# EAGLE design BMS Segment rev15 (EAGLE 9.6.2)
ENGINEER: Arvind Srinivasan
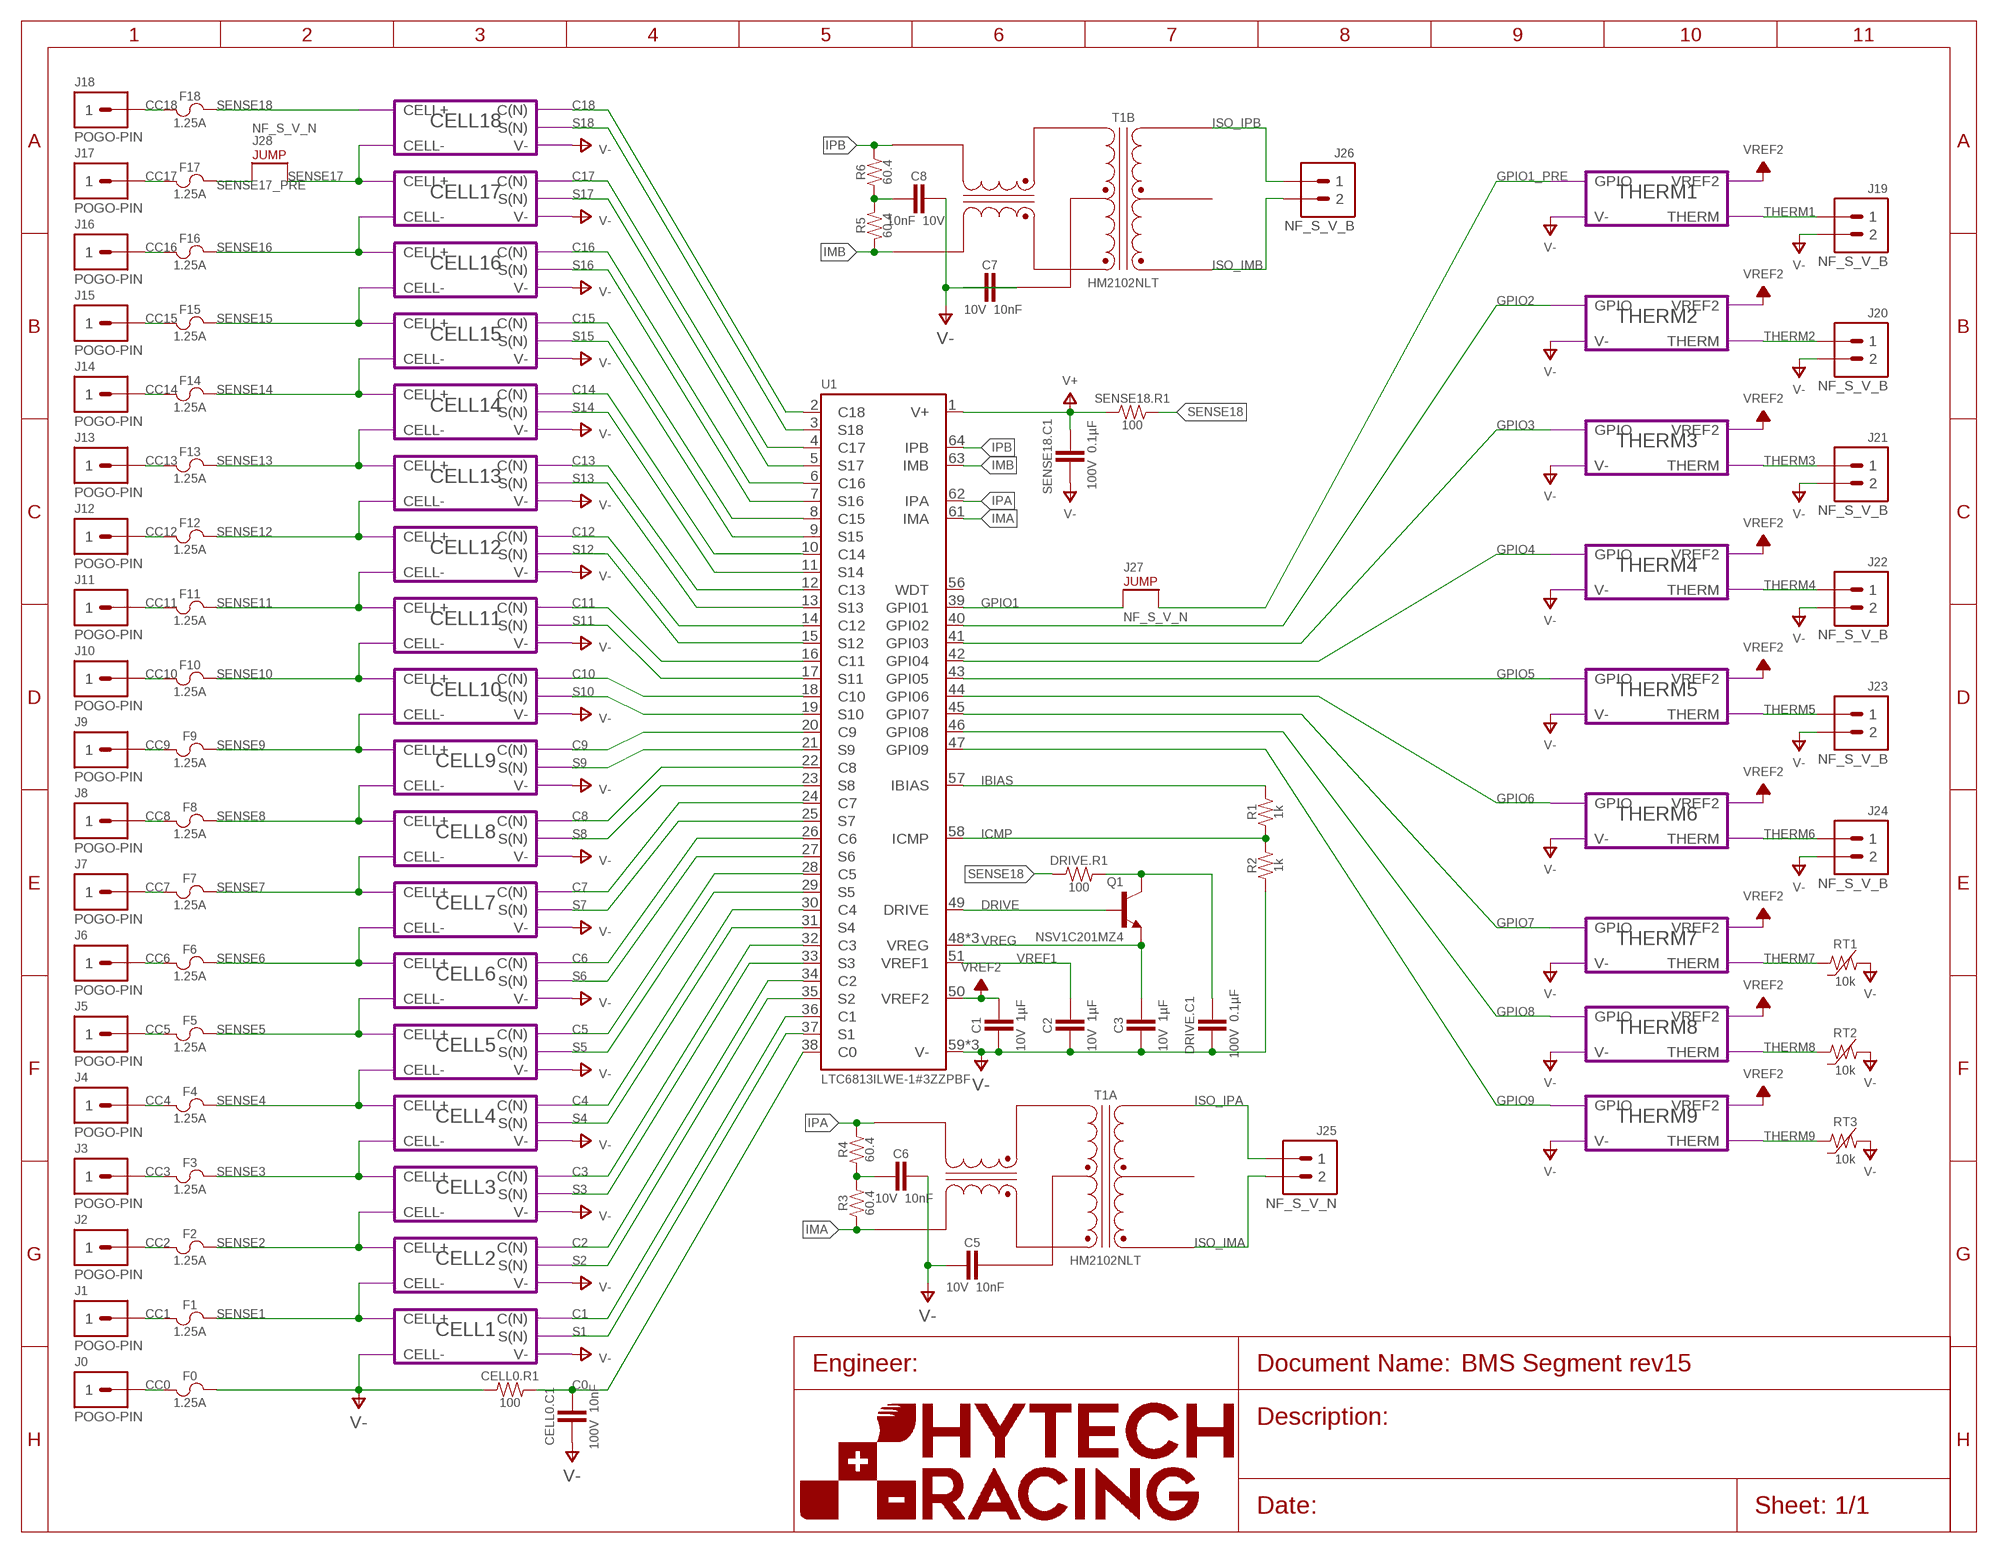
[diagram p0: schematic, sheet 1]
U$1 (FRAME_A): FRAME_DESCRIPTION: Default; ORIENTATION: LANDSCAPE; SIZE: A

## Parts
C1  CAPACITOR_0603_10V_1UF  [0603-CAP]
C2  CAPACITOR_0603_10V_1UF  [0603-CAP]
C3  CAPACITOR_0603_10V_1UF  [0603-CAP]
C5  CAPACITOR_0603_10V_10NF  [0603-CAP]
C6  CAPACITOR_0603_10V_10NF  [0603-CAP]
C7  CAPACITOR_0603_10V_10NF  [0603-CAP]
C8  CAPACITOR_0603_10V_10NF  [0603-CAP]
CELL0.C1  CAPACITOR_0603_100V_10NF  [0603-CAP]
CELL0.R1  RESISTOR_0603_100  [0603-RES]
DRIVE.C1  CAPACITOR_0603_100V_0.1UF  [0603-CAP]
DRIVE.R1  RESISTOR_0603_100  [0603-RES]
F0  FUSE0885  [0885]
F1  FUSE0885  [0885]
F2  FUSE0885  [0885]
F3  FUSE0885  [0885]
F4  FUSE0885  [0885]
F5  FUSE0885  [0885]
F6  FUSE0885  [0885]
F7  FUSE0885  [0885]
F8  FUSE0885  [0885]
F9  FUSE0885  [0885]
F10  FUSE0885  [0885]
F11  FUSE0885  [0885]
F12  FUSE0885  [0885]
F13  FUSE0885  [0885]
F14  FUSE0885  [0885]
F15  FUSE0885  [0885]
F16  FUSE0885  [0885]
F17  FUSE0885  [0885]
F18  FUSE0885  [0885]
J0  CONNECTOR-1  [807-22-001-10-02X101]
J1  CONNECTOR-1  [807-22-001-10-02X101]
J2  CONNECTOR-1  [807-22-001-10-02X101]
J3  CONNECTOR-1  [807-22-001-10-02X101]
J4  CONNECTOR-1  [807-22-001-10-02X101]
J5  CONNECTOR-1  [807-22-001-10-02X101]
J6  CONNECTOR-1  [807-22-001-10-02X101]
J7  CONNECTOR-1  [807-22-001-10-02X101]
J8  CONNECTOR-1  [807-22-001-10-02X101]
J9  CONNECTOR-1  [807-22-001-10-02X101]
J10  CONNECTOR-1  [807-22-001-10-02X101]
J11  CONNECTOR-1  [807-22-001-10-02X101]
J12  CONNECTOR-1  [807-22-001-10-02X101]
J13  CONNECTOR-1  [807-22-001-10-02X101]
J14  CONNECTOR-1  [807-22-001-10-02X101]
J15  CONNECTOR-1  [807-22-001-10-02X101]
J16  CONNECTOR-1  [807-22-001-10-02X101]
J17  CONNECTOR-1  [807-22-001-10-02X101]
J18  CONNECTOR-1  [807-22-001-10-02X101]
J19  CONNECTOR-2_NANOFIT_SMD_VERTICAL_BLACK  [MOLEX_NANOFIT_SMD_VERTICAL_02]
J20  CONNECTOR-2_NANOFIT_SMD_VERTICAL_BLACK  [MOLEX_NANOFIT_SMD_VERTICAL_02]
J21  CONNECTOR-2_NANOFIT_SMD_VERTICAL_BLACK  [MOLEX_NANOFIT_SMD_VERTICAL_02]
J22  CONNECTOR-2_NANOFIT_SMD_VERTICAL_BLACK  [MOLEX_NANOFIT_SMD_VERTICAL_02]
J23  CONNECTOR-2_NANOFIT_SMD_VERTICAL_BLACK  [MOLEX_NANOFIT_SMD_VERTICAL_02]
J24  CONNECTOR-2_NANOFIT_SMD_VERTICAL_BLACK  [MOLEX_NANOFIT_SMD_VERTICAL_02]
J25  CONNECTOR-2_NANOFIT_SMD_VERTICAL_NATURAL  [MOLEX_NANOFIT_SMD_VERTICAL_02]
J26  CONNECTOR-2_NANOFIT_SMD_VERTICAL_BLACK  [MOLEX_NANOFIT_SMD_VERTICAL_02]
J27  JUMPER_NANOFIT_SMD_VERTICAL_NATURAL  [MOLEX_NANOFIT_SMD_VERTICAL_02]
J28  JUMPER_NANOFIT_SMD_VERTICAL_NATURAL  [MOLEX_NANOFIT_SMD_VERTICAL_02]
Q1  TRANSISTOR_NPN  [SOT223]
R1  RESISTOR_0603_1K  [0603-RES]
R2  RESISTOR_0603_1K  [0603-RES]
R3  RESISTOR_0603_60.4  [0603-RES]
R4  RESISTOR_0603_60.4  [0603-RES]
R5  RESISTOR_0603_60.4  [0603-RES]
R6  RESISTOR_0603_60.4  [0603-RES]
RT1  THERMISTOR  [0603-RES]
RT2  THERMISTOR  [0603-RES]
RT3  THERMISTOR  [0603-RES]
SENSE18.C1  CAPACITOR_0603_100V_0.1UF  [0603-CAP]
SENSE18.R1  RESISTOR_0603_100  [0603-RES]
T1  TRANSFORMER  [HM2102NLT]
U1  LTC6813  [LQFP-64]

## Module instances
CELL1 = CELL
CELL2 = CELL
CELL3 = CELL
CELL4 = CELL
CELL5 = CELL
CELL6 = CELL
CELL7 = CELL
CELL8 = CELL
CELL9 = CELL
CELL10 = CELL
CELL11 = CELL
CELL12 = CELL
CELL13 = CELL
CELL14 = CELL
CELL15 = CELL
CELL16 = CELL
CELL17 = CELL
CELL18 = CELL
THERM1 = THERM
THERM2 = THERM
THERM3 = THERM
THERM4 = THERM
THERM5 = THERM
THERM6 = THERM
THERM7 = THERM
THERM8 = THERM
THERM9 = THERM

## Nets
C0: CELL0.C1.1 CELL0.R1.2 U1.38(C0)
C1: U1.36(C1) ; port CELL1.C(N)
C2: U1.34(C2) ; port CELL2.C(N)
C3: U1.32(C3) ; port CELL3.C(N)
C4: U1.30(C4) ; port CELL4.C(N)
C5: U1.28(C5) ; port CELL5.C(N)
C6: U1.26(C6) ; port CELL6.C(N)
C7: U1.24(C7) ; port CELL7.C(N)
C8: U1.22(C8) ; port CELL8.C(N)
C9: U1.20(C9) ; port CELL9.C(N)
C10: U1.18(C10) ; port CELL10.C(N)
C11: U1.16(C11) ; port CELL11.C(N)
C12: U1.14(C12) ; port CELL12.C(N)
C13: U1.12(C13) ; port CELL13.C(N)
C14: U1.10(C14) ; port CELL14.C(N)
C15: U1.8(C15) ; port CELL15.C(N)
C16: U1.6(C16) ; port CELL16.C(N)
C17: U1.4(C17) ; port CELL17.C(N)
C18: U1.2(C18) ; port CELL18.C(N)
CC0: F0.1 J0.1
CC1: F1.1 J1.1
CC2: F2.1 J2.1
CC3: F3.1 J3.1
CC4: F4.1 J4.1
CC5: F5.1 J5.1
CC6: F6.1 J6.1
CC7: F7.1 J7.1
CC8: F8.1 J8.1
CC9: F9.1 J9.1
CC10: F10.1 J10.1
CC11: F11.1 J11.1
CC12: F12.1 J12.1
CC13: F13.1 J13.1
CC14: F14.1 J14.1
CC15: F15.1 J15.1
CC16: F16.1 J16.1
CC17: F17.1 J17.1
CC18: F18.1 J18.1
DRIVE: Q1.1(BASE) U1.49(DRIVE)
GPIO1: J27.1 U1.39(GPI01)
GPIO1_PRE: J27.2 ; port THERM1.GPIO
GPIO2: U1.40(GPI02) ; port THERM2.GPIO
GPIO3: U1.41(GPI03) ; port THERM3.GPIO
GPIO4: U1.42(GPI04) ; port THERM4.GPIO
GPIO5: U1.43(GPI05) ; port THERM5.GPIO
GPIO6: U1.44(GPI06) ; port THERM6.GPIO
GPIO7: U1.45(GPI07) ; port THERM7.GPIO
GPIO8: U1.46(GPI08) ; port THERM8.GPIO
GPIO9: U1.47(GPI09) ; port THERM9.GPIO
IBIAS: R1.2 U1.57(IBIAS)
ICMP: R1.1 R2.2 U1.58(ICMP)
IMA: R3.1 T1.12(A:TD+) U1.61(IMA)
IMB: R5.2 T1.9(B:TD+) U1.63(IMB)
IPA: R4.2 T1.10(A:TD-) U1.62(IPA)
IPB: R6.2 T1.7(B:TD-) U1.64(IPB)
ISO_IMA: J25.2 T1.1(A:MX+)
ISO_IMB: J26.2 T1.4(B:MX+)
ISO_IPA: J25.1 T1.3(A:MX-)
ISO_IPB: J26.1 T1.6(B:MX-)
N$3: C5.1 T1.11(A:TCT)
N$4: C7.2 T1.8(B:TCT)
N$5: C6.2 R3.2 R4.1
N$15: DRIVE.C1.1 DRIVE.R1.2 Q1.2(COLLECTOR) Q1.4(COLLECTOR)
N$18: C8.1 R5.1 R6.1
S1: U1.37(S1) ; port CELL1.S(N)
S2: U1.35(S2) ; port CELL2.S(N)
S3: U1.33(S3) ; port CELL3.S(N)
S4: U1.31(S4) ; port CELL4.S(N)
S5: U1.29(S5) ; port CELL5.S(N)
S6: U1.27(S6) ; port CELL6.S(N)
S7: U1.25(S7) ; port CELL7.S(N)
S8: U1.23(S8) ; port CELL8.S(N)
S9: U1.21(S9) ; port CELL9.S(N)
S10: U1.19(S10) ; port CELL10.S(N)
S11: U1.17(S11) ; port CELL11.S(N)
S12: U1.15(S12) ; port CELL12.S(N)
S13: U1.13(S13) ; port CELL13.S(N)
S14: U1.11(S14) ; port CELL14.S(N)
S15: U1.9(S15) ; port CELL15.S(N)
S16: U1.7(S16) ; port CELL16.S(N)
S17: U1.5(S17) ; port CELL17.S(N)
S18: U1.3(S18) ; port CELL18.S(N)
SENSE1: F1.2 ; port CELL1.CELL+ CELL2.CELL-
SENSE2: F2.2 ; port CELL2.CELL+ CELL3.CELL-
SENSE3: F3.2 ; port CELL3.CELL+ CELL4.CELL-
SENSE4: F4.2 ; port CELL4.CELL+ CELL5.CELL-
SENSE5: F5.2 ; port CELL5.CELL+ CELL6.CELL-
SENSE6: F6.2 ; port CELL6.CELL+ CELL7.CELL-
SENSE7: F7.2 ; port CELL7.CELL+ CELL8.CELL-
SENSE8: F8.2 ; port CELL8.CELL+ CELL9.CELL-
SENSE9: F9.2 ; port CELL9.CELL+ CELL10.CELL-
SENSE10: F10.2 ; port CELL10.CELL+ CELL11.CELL-
SENSE11: F11.2 ; port CELL11.CELL+ CELL12.CELL-
SENSE12: F12.2 ; port CELL12.CELL+ CELL13.CELL-
SENSE13: F13.2 ; port CELL13.CELL+ CELL14.CELL-
SENSE14: F14.2 ; port CELL14.CELL+ CELL15.CELL-
SENSE15: F15.2 ; port CELL15.CELL+ CELL16.CELL-
SENSE16: F16.2 ; port CELL16.CELL+ CELL17.CELL-
SENSE17: J28.2 ; port CELL17.CELL+ CELL18.CELL-
SENSE17_PRE: F17.2 J28.1
SENSE18: DRIVE.R1.1 F18.2 SENSE18.R1.2 ; port CELL18.CELL+
THERM1: J19.1 ; port THERM1.THERM
THERM2: J20.1 ; port THERM2.THERM
THERM3: J21.1 ; port THERM3.THERM
THERM4: J22.1 ; port THERM4.THERM
THERM5: J23.1 ; port THERM5.THERM
THERM6: J24.1 ; port THERM6.THERM
THERM7: RT1.2 ; port THERM7.THERM
THERM8: RT2.2 ; port THERM8.THERM
THERM9: RT3.2 ; port THERM9.THERM
V+: SENSE18.C1.1 SENSE18.R1.1 U1.1(V+)
V-: C1.2 C2.2 C3.2 C5.2 C6.1 C7.1 C8.2 CELL0.C1.2 CELL0.R1.1 DRIVE.C1.2 F0.2 J19.2 J20.2 J21.2 J22.2 J23.2 J24.2 R2.1 RT1.1 RT2.1 RT3.1 SENSE18.C1.2 U1.59(V-) U1.60(V-) U1.65(V-) ; port CELL1.CELL- CELL1.V- CELL2.V- CELL3.V- CELL4.V- CELL5.V- CELL6.V- CELL7.V- CELL8.V- CELL9.V- CELL10.V- CELL11.V- CELL12.V- CELL13.V- CELL14.V- CELL15.V- CELL16.V- CELL17.V- CELL18.V- THERM1.V- THERM2.V- THERM3.V- THERM4.V- THERM5.V- THERM6.V- THERM7.V- THERM8.V- THERM9.V-
VREF1: C2.1 U1.51(VREF1)
VREF2: C1.1 U1.50(VREF2) ; port THERM1.VREF2 THERM2.VREF2 THERM3.VREF2 THERM4.VREF2 THERM5.VREF2 THERM6.VREF2 THERM7.VREF2 THERM8.VREF2 THERM9.VREF2
VREG: C3.1 Q1.3(EMITTER) U1.48(VREG) U1.52(VREG) U1.55(VREG)
Unconnected: T1.2(A:MCT) T1.5(B:MCT) U1.56(WDT)

## Library data of the parts
C1-C3 = HyTechDevices:CAPACITOR_?_*: Capacitor, Non-Polarized VJ...1BC Series Datasheet <https://www.mouser.com/datasheet/2/427/vjw1bcbascomseries-1762447.pdf> Samsung Datasheet <https://www.mouser.com/datasheet/2/585/MLCC-1837944.pdf> Walsin Datasheet <https://www.mouser.com/datasheet/2/210/WTC_MLCC_General_Purpose-1534899.pdf>; CAPACITANCE: 1µF; DKPN: 311-1796-1-ND; MANUFACTURER: Yageo; MOPN: 603-CC603KRX7R6BB105; MPN: CC0603KRX7R6BB105; TOLERANCE: 10%; VOLTAGE: 10V
C5-C8 = HyTechDevices:CAPACITOR_?_*: Capacitor, Non-Polarized VJ...1BC Series Datasheet <https://www.mouser.com/datasheet/2/427/vjw1bcbascomseries-1762447.pdf> Samsung Datasheet <https://www.mouser.com/datasheet/2/585/MLCC-1837944.pdf> Walsin Datasheet <https://www.mouser.com/datasheet/2/210/WTC_MLCC_General_Purpose-1534899.pdf>; CAPACITANCE: 10nF; DKPN: 311-4054-1-ND; MANUFACTURER: Yageo; MOPN: 603-CC603KRX7R6BB103; MPN: CC0603KRX7R6BB103; TOLERANCE: 10%; VOLTAGE: 10V
CELL0.C1 = HyTechDevices:CAPACITOR_?_*: Capacitor, Non-Polarized VJ...1BC Series Datasheet <https://www.mouser.com/datasheet/2/427/vjw1bcbascomseries-1762447.pdf> Samsung Datasheet <https://www.mouser.com/datasheet/2/585/MLCC-1837944.pdf> Walsin Datasheet <https://www.mouser.com/datasheet/2/210/WTC_MLCC_General_Purpose-1534899.pdf>; CAPACITANCE: 10nF; DKPN: 311-1788-1-ND; MANUFACTURER: Yageo; MOPN: 603-CC603KRX7R0BB103; MPN: CC0603KRX7R0BB103; TOLERANCE: 10%; VOLTAGE: 100V
CELL0.R1 DRIVE.R1 SENSE18.R1 = HyTechDevices:RESISTOR_?_*: Resistor PWR163 Series <https://www.mouser.com/datasheet/2/54/pwr163-777985.pdf> AC Series <https://www.mouser.com/datasheet/2/447/Yageo_PYu_AC_51_RoHS_L_7_1714230-1874691.pdf> PU Series <https://www.mouser.com/datasheet/2/447/PYu-PU_51_RoHS_L_6-1504619.pdf>; DKPN: 311-100HRCT-ND; MANUFACTURER: Yageo; MOPN: 603-RC0603FR-07100RL; MPN: RC0603FR-07100RL; POWER: 0.1W; RESISTANCE: 100; TOLERANCE: 1%; VOLTAGE: 75V
DRIVE.C1 SENSE18.C1 = HyTechDevices:CAPACITOR_?_*: Capacitor, Non-Polarized VJ...1BC Series Datasheet <https://www.mouser.com/datasheet/2/427/vjw1bcbascomseries-1762447.pdf> Samsung Datasheet <https://www.mouser.com/datasheet/2/585/MLCC-1837944.pdf> Walsin Datasheet <https://www.mouser.com/datasheet/2/210/WTC_MLCC_General_Purpose-1534899.pdf>; CAPACITANCE: 0.1µF; DKPN: 311-1523-1-ND; MANUFACTURER: Yageo; MOPN: 603-CC603KRX7R0BB104; MPN: CC0603KRX7R0BB104; TOLERANCE: 10%; VOLTAGE: 100V
F0 F1-F18 = HyTechDevices:FUSE: Ceramic Surface Mount Fuse Datasheet <https://www.mouser.com/datasheet/2/358/typ_SMD_SPT-1276028.pdf> Fuse/Fuseclips Keystone Electronics 3568 Fuse Mouser Part <http://www.mouser.com/ProductDetail/Keystone-Electronics/3568> Datasheet <http://www.mouser.com/ds/2/215/568-742601.pdf> Bussman/Eaton Midget Fuse Clip 1A3400 <http://www.mouser.com/ProductDetail/Bussmann-Eaton/BK-1A3400-09-R/?qs=sGAEpiMZZMuG%252bgnN5hGYGzzlAelq2OxnKqVSMVjq8I4%3d> Schurter 0751.0110 Brass Fuse Clip Datasheet <http://www.mouser.com/ds/2/358/typ_OG__Clip__5x20-2553.pdf> Bel Fuse 0ZCF Series Surface Mount PTC (resettable) Fuse Datasheet <https://belfuse.com/resources/CircuitProtection/datasheets/0ZCF%20Nov2016.pdf> Littelfuse 1812L Series Surface Mount PTC (resettable) Fuse Datasheet <https://m.littelfuse.com/~/media/electronics/datasheets/resettable_ptcs/littelfuse_ptc_1812l_datasheet.pdf.pdf> Ceramic SMD Surface Mount Fuse Datasheet <https://www.mouser.com/datasheet/2/240/Littelfuse_Fuse_885_Datasheet_pdf-1371443.pdf>; CURRENT: 1.25A; DKPN: F10986CT-ND; MANUFACTURER: Littelfuse Inc.; MOPN: 576-08851.25DR; MPN: 08851.25DR
J0 J1-J18 = HyTechDevices:CONNECTOR-1: 1 Pin Connector Pogo pin datasheet <https://www.mouser.com/datasheet/2/273/Mill-Max_03212019_807-22-001-10-020101-1545127.pdf>; DKPN: 807-22-001-10-022101-ND; MANUFACTURER: Mill-Max Manufacturing Corp.; MODEL: POGO-PIN; MOPN: 575-8072200110022101; MPN: 807-22-001-10-022101
J19-J24 J26 = HyTechDevices:CONNECTOR-2_?_*: 2 Pin Connector; MANUFACTURER: Molex; MODEL: NF_S_V_B; MPN: 1054291304
J25 = HyTechDevices:CONNECTOR-2_?_*: 2 Pin Connector; MANUFACTURER: Molex; MODEL: NF_S_V_N; MPN: 1054312302
J27 J28 = HyTechDevices:JUMPER_?_*: 2 Pin Connector; MANUFACTURER: Molex; MODEL: NF_S_V_N; MPN: 1054312302
Q1 = HyTechDevices:TRANSISTOR_NPN: NPN Transistor Datasheet <http://www.onsemi.com/pub/Collateral/NSS1C201MZ4-D.PDF> MAX current: 2.0A MAX voltage: 100V; DKPN: NSV1C201MZ4T1GOSCT-ND; MANUFACTURER: ON Semiconductor; MOPN: 863-NSV1C201MZ4T1G; MPN: NSV1C201MZ4
R1 R2 = HyTechDevices:RESISTOR_?_*: Resistor PWR163 Series <https://www.mouser.com/datasheet/2/54/pwr163-777985.pdf> AC Series <https://www.mouser.com/datasheet/2/447/Yageo_PYu_AC_51_RoHS_L_7_1714230-1874691.pdf> PU Series <https://www.mouser.com/datasheet/2/447/PYu-PU_51_RoHS_L_6-1504619.pdf>; DKPN: 311-1.00KHRCT-ND; MANUFACTURER: Yageo; MOPN: 603-RC0603FR-071KL; MPN: RC0603FR-071KL; POWER: 0.1W; RESISTANCE: 1k; TOLERANCE: 1%; VOLTAGE: 75V
R3-R6 = HyTechDevices:RESISTOR_?_*: Resistor PWR163 Series <https://www.mouser.com/datasheet/2/54/pwr163-777985.pdf> AC Series <https://www.mouser.com/datasheet/2/447/Yageo_PYu_AC_51_RoHS_L_7_1714230-1874691.pdf> PU Series <https://www.mouser.com/datasheet/2/447/PYu-PU_51_RoHS_L_6-1504619.pdf>; DKPN: 311-60.4HRCT-ND; MANUFACTURER: Yageo; MOPN: 603-RC0603FR-0760R4L; MPN: RC0603FR-0760R4L; POWER: 0.1W; RESISTANCE: 60.4; TOLERANCE: 1%; VOLTAGE: 75V
RT1-RT3 = HyTechDevices:THERMISTOR: Thermistor Datasheet Murata <https://www.murata.com/-/media/webrenewal/support/library/catalog/products/thermistor/r03e.ashx?la=en-us>; DKPN: 490-18147-1-ND; MANUFACTURER: Murata Electronics; MOPN: 81-NCU18XH103D60RB; MPN: NCU18XH103D60RB; RESISTANCE: 10k
T1 = HyTechDevices:TRANSFORMER: 2 Channel SMT Transformer Turns ratio: 1CT: 1CT Isolation Voltage: 4300 VDC Inductance: 150 uH Leakage Inductance: 0.50 uH max DataSheet <https://www.mouser.com/datasheet/2/336/HM2102NL-1218600.pdf>; DKPN: 1840-1034-1-ND; MANUFACTURER: Pulse Electronics Network; MOPN: 673-HM2102NLT; MPN: HM2102NLT
U1 = HyTechDevices:LTC6813: LTC6813 18-Cell Battery Monitor Datasheet <https://www.analog.com/media/en/technical-documentation/data-sheets/LTC6813-1.pdf>; DKPN: LTC6813ILWE-1#3ZZPBF-ND; MANUFACTURER: Analog Devices Inc.; MPN: LTC6813ILWE-1#3ZZPBF

## Module CELL
Ports: CELL+(in) S(N)(in) C(N)(out) CELL-(out) V-(pwr)
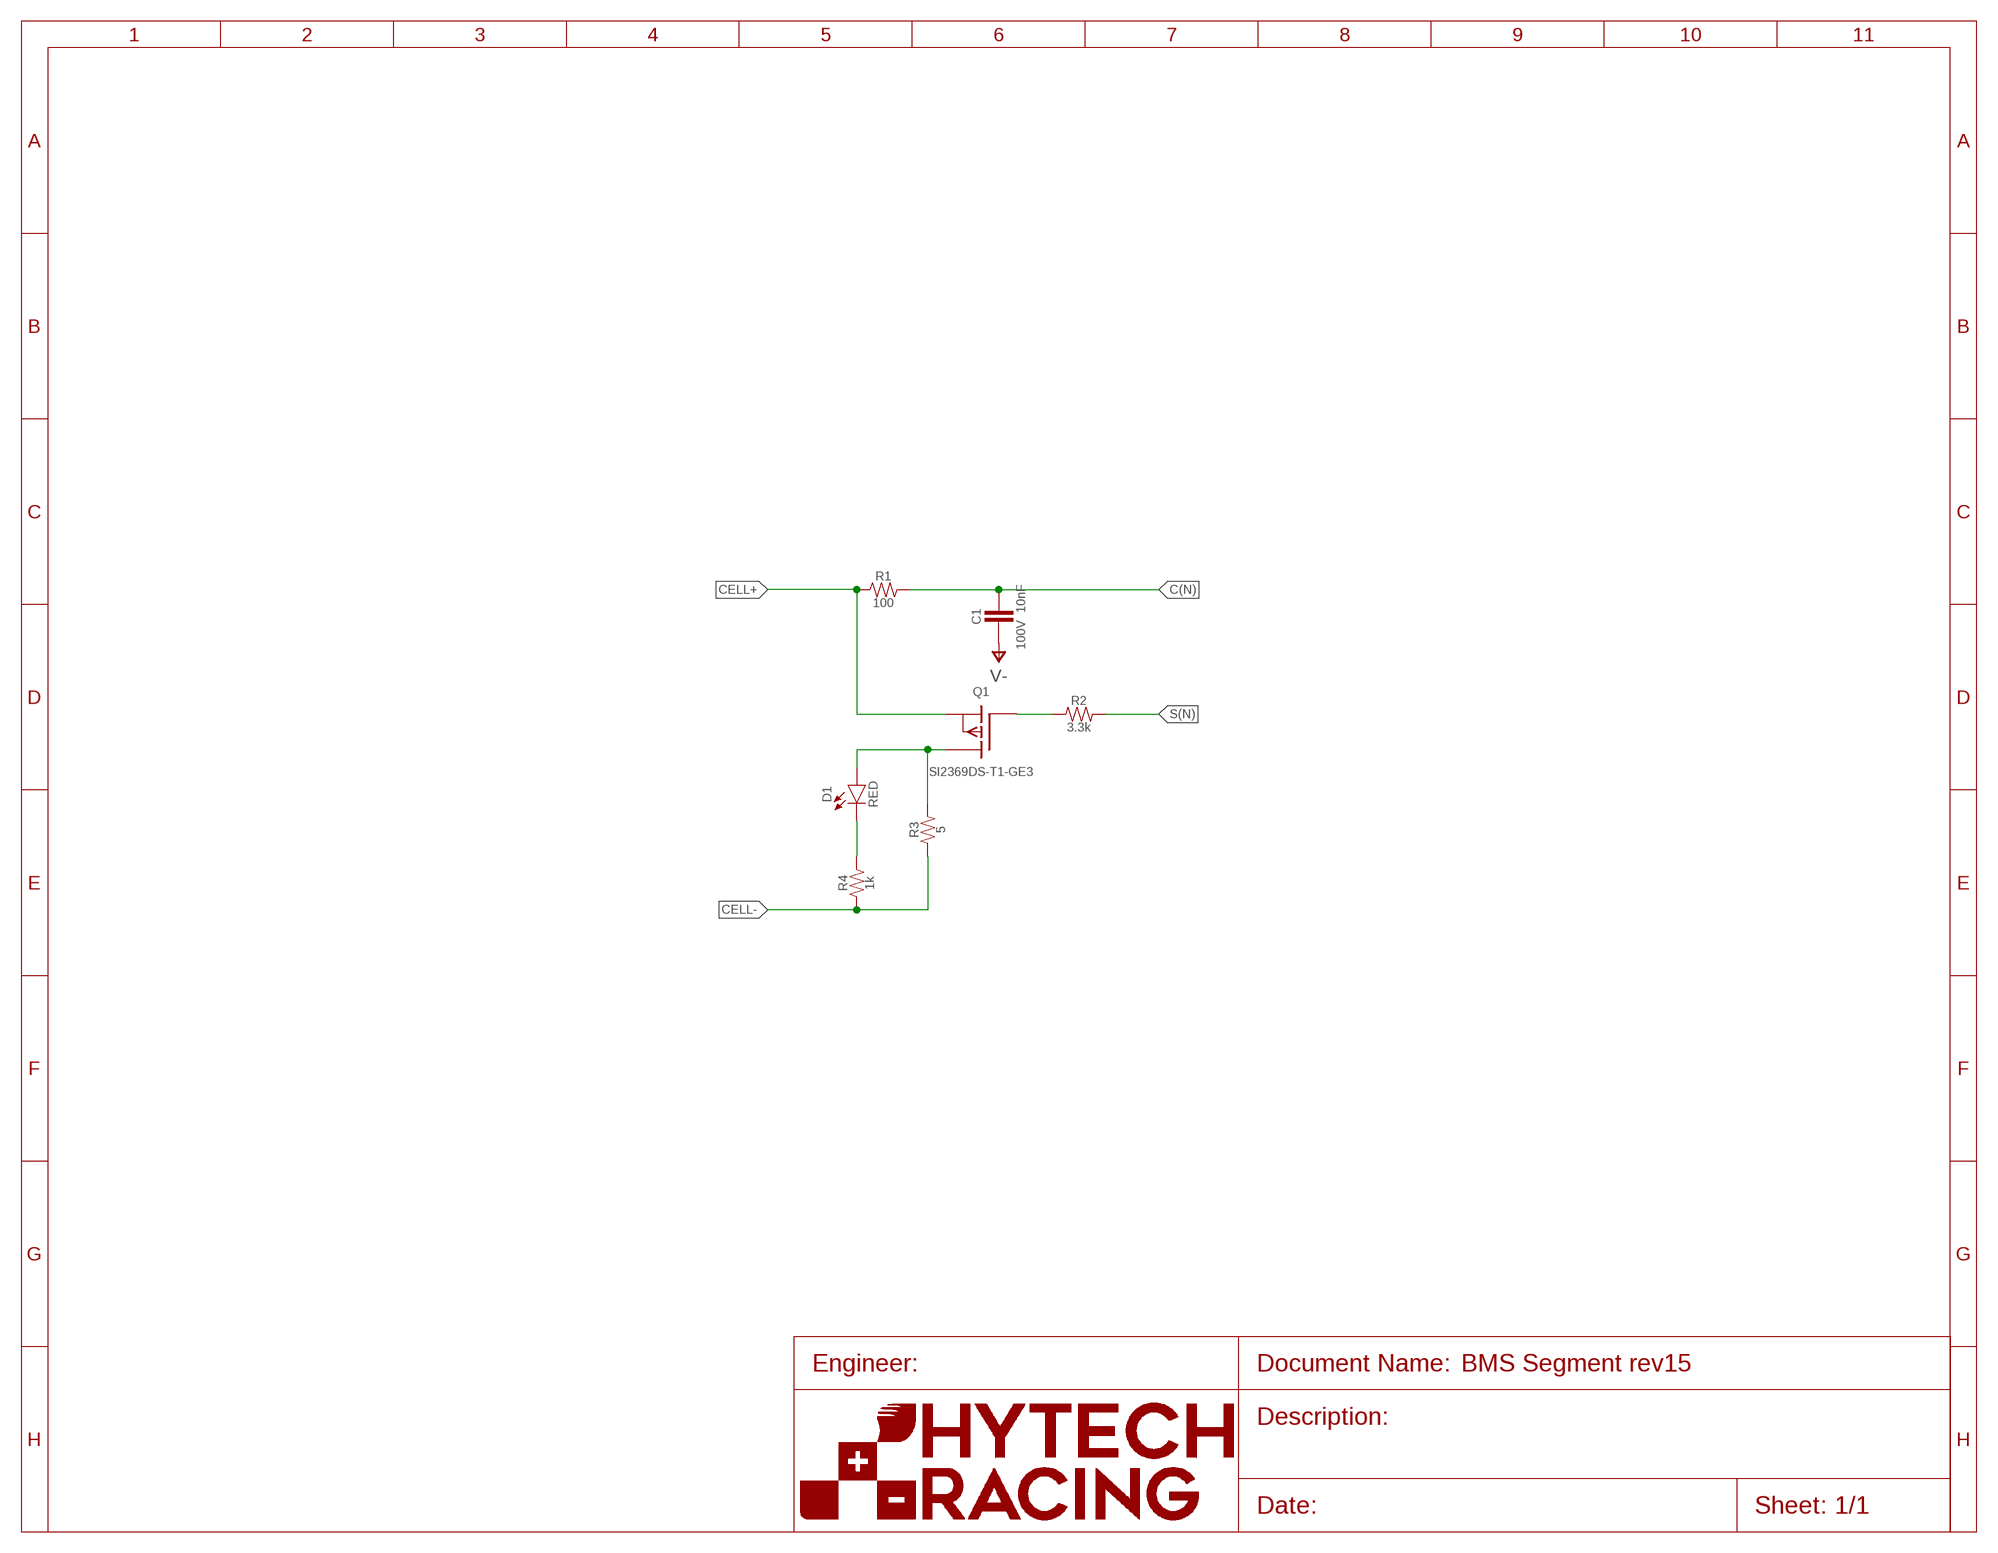
[diagram p1: schematic, module CELL, sheet 1]
U$1 (FRAME_A): FRAME_DESCRIPTION: Default; ORIENTATION: LANDSCAPE; SIZE: A

### Parts
C1  CAPACITOR_0603_100V_10NF  [0603-CAP]
D1  LED_0603_RED  [0603-LED]
Q1  TRANSISTOR_P_MOS_SOT23_SI2369DS-T1-GE3  [SOT-23]
R1  RESISTOR_0603_100  [0603-RES]
R2  RESISTOR_0603_3.3K  [0603-RES]
R3  RESISTOR_PWR163_5  [PWR163]
R4  RESISTOR_0603_1K  [0603-RES]

### Nets
C(N): C1.1 R1.2
CELL+: Q1.2(S) R1.1
CELL-: R3.1 R4.1
N$5: Q1.1(G) R2.1
N$6: D1.2(A) Q1.3(D) R3.2
N$7: D1.1(C) R4.2
S(N): R2.2
V-: C1.2

### Library data of the parts
C1 = HyTechDevices:CAPACITOR_?_*: Capacitor, Non-Polarized VJ...1BC Series Datasheet <https://www.mouser.com/datasheet/2/427/vjw1bcbascomseries-1762447.pdf> Samsung Datasheet <https://www.mouser.com/datasheet/2/585/MLCC-1837944.pdf> Walsin Datasheet <https://www.mouser.com/datasheet/2/210/WTC_MLCC_General_Purpose-1534899.pdf>; CAPACITANCE: 10nF; DKPN: 311-1788-1-ND; MANUFACTURER: Yageo; MOPN: 603-CC603KRX7R0BB103; MPN: CC0603KRX7R0BB103; TOLERANCE: 10%; VOLTAGE: 100V
D1 = HyTechDevices:LED_?_*: LED; COLOR: RED; DKPN: 754-1786-1-ND; MANUFACTURER: Kingbright; MOPN: 604-APT1608SECKJ3PRV; MPN: APT1608SECK/J3-PRV
Q1 = HyTechDevices:TRANSISTOR_P_MOS_?_*: MOSFET P Channel Datasheet <https://www.mouser.com/datasheet/2/427/si2369d-1764360.pdf>; DKPN: SI2369DS-T1-GE3CT-ND; MANUFACTURER: Vishay Siliconix; MOPN: 78-SI2369DS-T1-GE3; MPN: SI2369DS-T1-GE3
R1 = HyTechDevices:RESISTOR_?_*: Resistor PWR163 Series <https://www.mouser.com/datasheet/2/54/pwr163-777985.pdf> AC Series <https://www.mouser.com/datasheet/2/447/Yageo_PYu_AC_51_RoHS_L_7_1714230-1874691.pdf> PU Series <https://www.mouser.com/datasheet/2/447/PYu-PU_51_RoHS_L_6-1504619.pdf>; DKPN: 311-100HRCT-ND; MANUFACTURER: Yageo; MOPN: 603-RC0603FR-07100RL; MPN: RC0603FR-07100RL; POWER: 0.1W; RESISTANCE: 100; TOLERANCE: 1%; VOLTAGE: 75V
R2 = HyTechDevices:RESISTOR_?_*: Resistor PWR163 Series <https://www.mouser.com/datasheet/2/54/pwr163-777985.pdf> AC Series <https://www.mouser.com/datasheet/2/447/Yageo_PYu_AC_51_RoHS_L_7_1714230-1874691.pdf> PU Series <https://www.mouser.com/datasheet/2/447/PYu-PU_51_RoHS_L_6-1504619.pdf>; DKPN: 311-3.30KHRCT-ND; MANUFACTURER: Yageo; MOPN: 603-RC0603FR-073K3L; MPN: RC0603FR-073K3L; POWER: 0.1W; RESISTANCE: 3.3k; TOLERANCE: 1%; VOLTAGE: 75V
R3 = HyTechDevices:RESISTOR_?_*: Resistor PWR163 Series <https://www.mouser.com/datasheet/2/54/pwr163-777985.pdf> AC Series <https://www.mouser.com/datasheet/2/447/Yageo_PYu_AC_51_RoHS_L_7_1714230-1874691.pdf> PU Series <https://www.mouser.com/datasheet/2/447/PYu-PU_51_RoHS_L_6-1504619.pdf>; DKPN: PWR163S-25-5R00FECT-ND; MANUFACTURER: Bourns Inc.; MOPN: 652-PWR163S255R00FE; MPN: PWR163S-25-5R00FE; POWER: 25W; RESISTANCE: 5; TOLERANCE: 1%; VOLTAGE: 2000V
R4 = HyTechDevices:RESISTOR_?_*: Resistor PWR163 Series <https://www.mouser.com/datasheet/2/54/pwr163-777985.pdf> AC Series <https://www.mouser.com/datasheet/2/447/Yageo_PYu_AC_51_RoHS_L_7_1714230-1874691.pdf> PU Series <https://www.mouser.com/datasheet/2/447/PYu-PU_51_RoHS_L_6-1504619.pdf>; DKPN: 311-1.00KHRCT-ND; MANUFACTURER: Yageo; MOPN: 603-RC0603FR-071KL; MPN: RC0603FR-071KL; POWER: 0.1W; RESISTANCE: 1k; TOLERANCE: 1%; VOLTAGE: 75V

## Module THERM
Ports: GPIO(out) V-(pwr) VREF2(pwr) THERM(io)
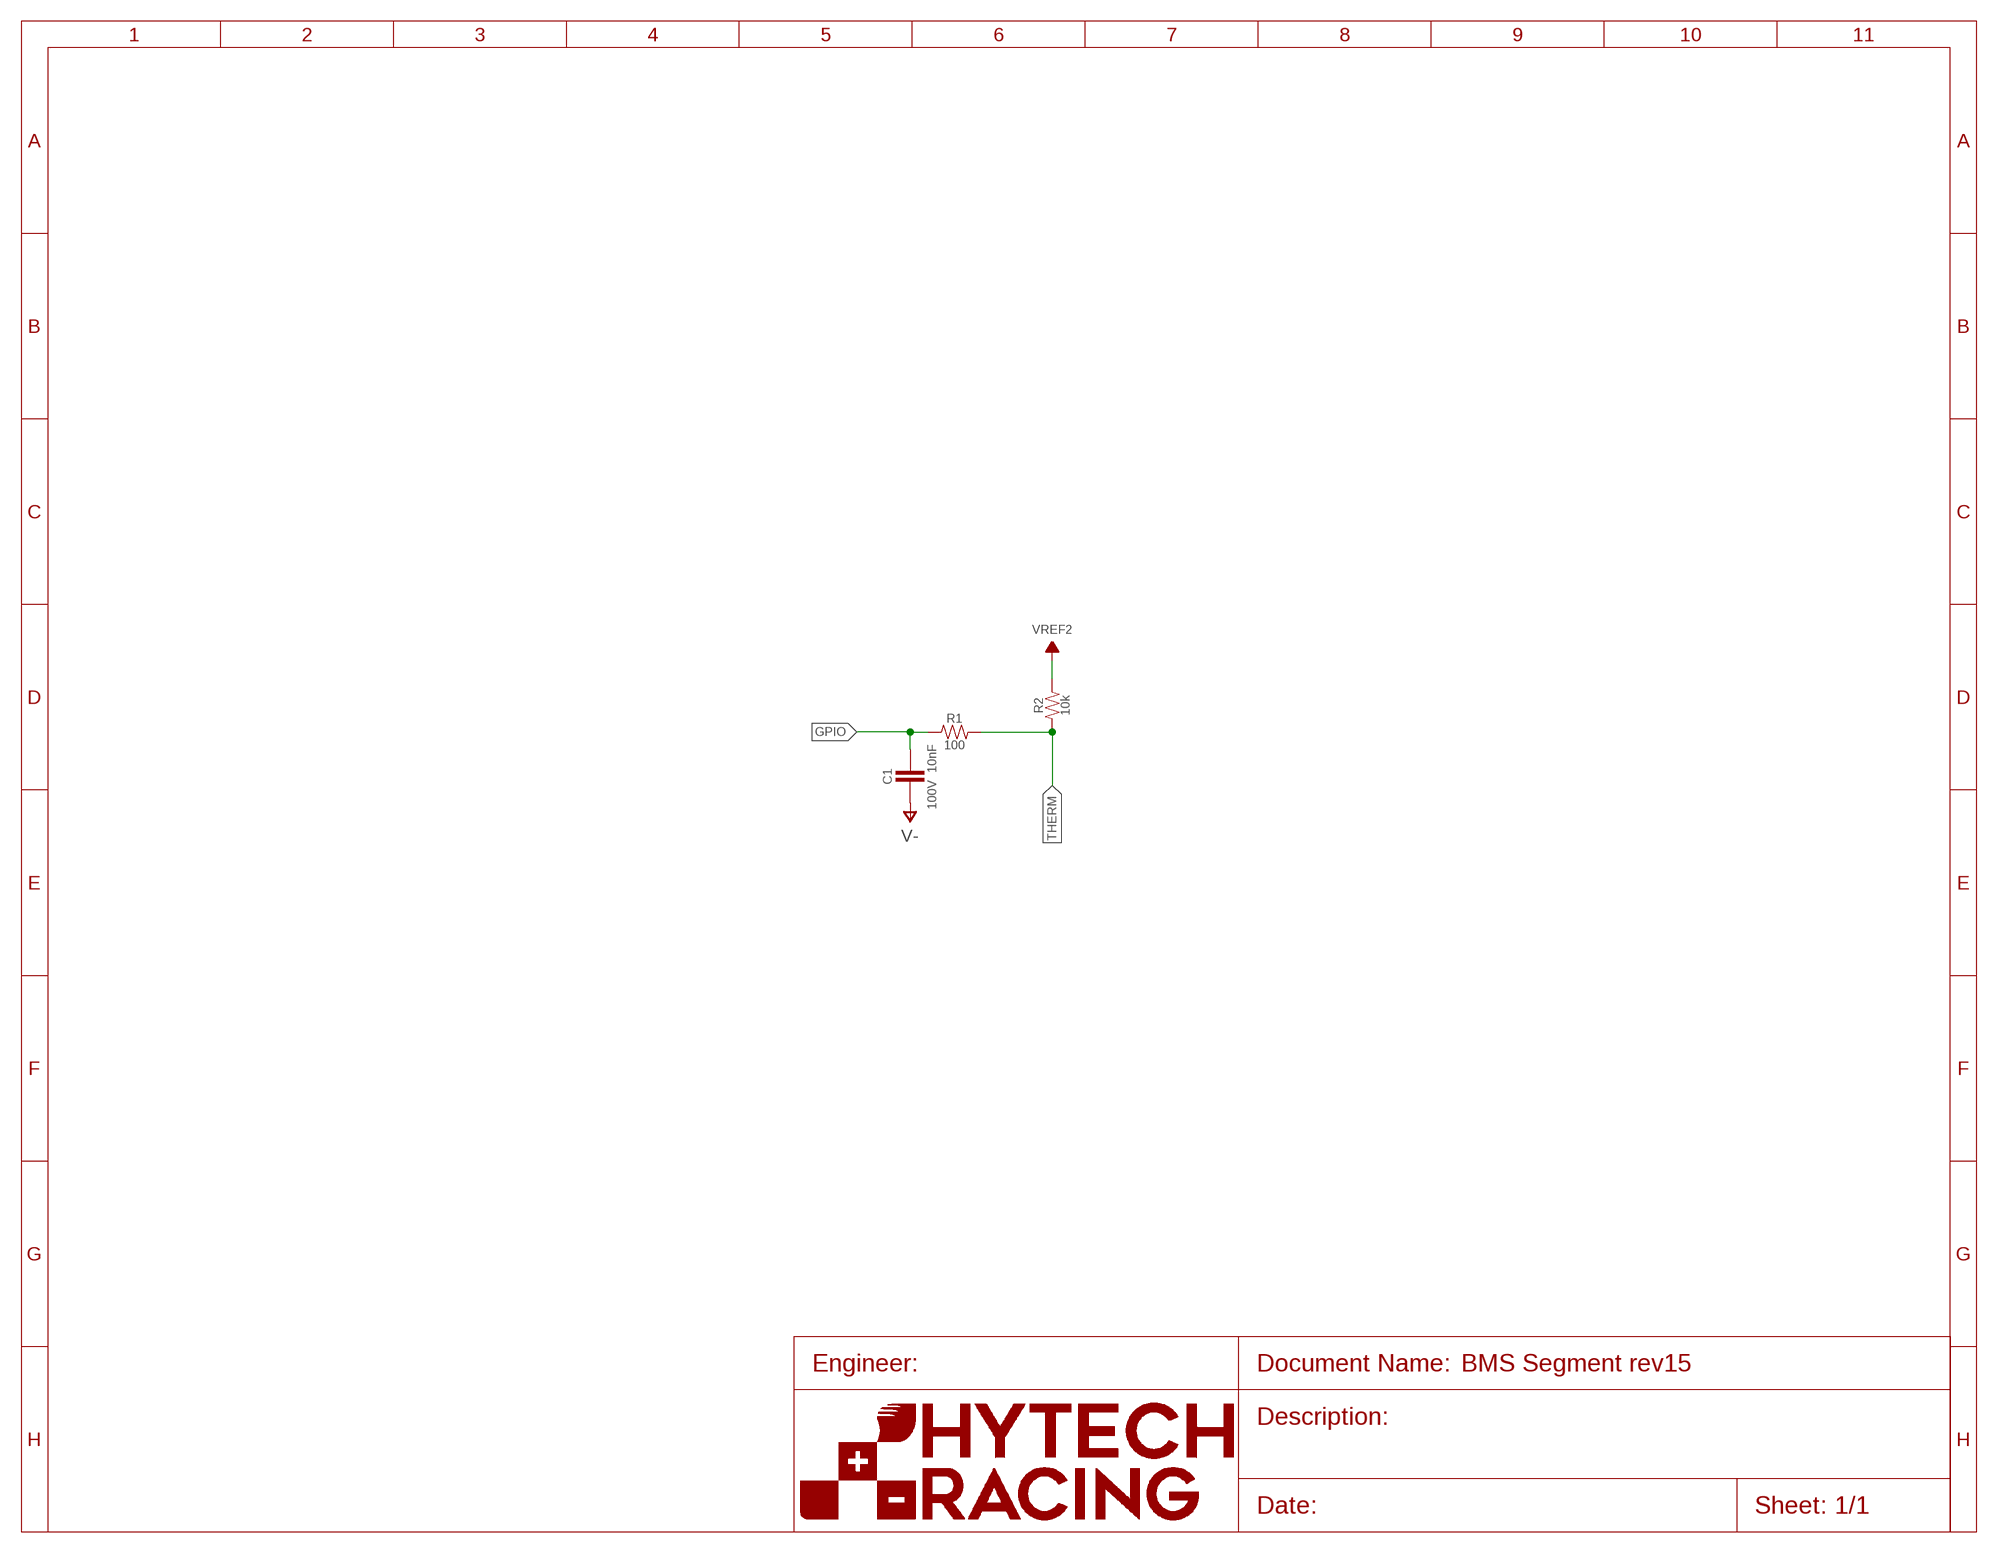
[diagram p2: schematic, module THERM, sheet 1]
U$1 (FRAME_A): FRAME_DESCRIPTION: Default; ORIENTATION: LANDSCAPE; SIZE: A

### Parts
C1  CAPACITOR_0603_100V_10NF  [0603-CAP]
R1  RESISTOR_0603_100  [0603-RES]
R2  RESISTOR_0603_10K  [0603-RES]

### Nets
GPIO: C1.1 R1.1
THERM: R1.2 R2.1
V-: C1.2
VREF2: R2.2

### Library data of the parts
C1 = HyTechDevices:CAPACITOR_?_*: Capacitor, Non-Polarized VJ...1BC Series Datasheet <https://www.mouser.com/datasheet/2/427/vjw1bcbascomseries-1762447.pdf> Samsung Datasheet <https://www.mouser.com/datasheet/2/585/MLCC-1837944.pdf> Walsin Datasheet <https://www.mouser.com/datasheet/2/210/WTC_MLCC_General_Purpose-1534899.pdf>; CAPACITANCE: 10nF; DKPN: 311-1788-1-ND; MANUFACTURER: Yageo; MOPN: 603-CC603KRX7R0BB103; MPN: CC0603KRX7R0BB103; TOLERANCE: 10%; VOLTAGE: 100V
R1 = HyTechDevices:RESISTOR_?_*: Resistor PWR163 Series <https://www.mouser.com/datasheet/2/54/pwr163-777985.pdf> AC Series <https://www.mouser.com/datasheet/2/447/Yageo_PYu_AC_51_RoHS_L_7_1714230-1874691.pdf> PU Series <https://www.mouser.com/datasheet/2/447/PYu-PU_51_RoHS_L_6-1504619.pdf>; DKPN: 311-100HRCT-ND; MANUFACTURER: Yageo; MOPN: 603-RC0603FR-07100RL; MPN: RC0603FR-07100RL; POWER: 0.1W; RESISTANCE: 100; TOLERANCE: 1%; VOLTAGE: 75V
R2 = HyTechDevices:RESISTOR_?_*: Resistor PWR163 Series <https://www.mouser.com/datasheet/2/54/pwr163-777985.pdf> AC Series <https://www.mouser.com/datasheet/2/447/Yageo_PYu_AC_51_RoHS_L_7_1714230-1874691.pdf> PU Series <https://www.mouser.com/datasheet/2/447/PYu-PU_51_RoHS_L_6-1504619.pdf>; DKPN: 311-10.0KHRCT-ND; MANUFACTURER: Yageo; MOPN: 603-RC0603FR-0710KL; MPN: RC0603FR-0710KL; POWER: 0.1W; RESISTANCE: 10k; TOLERANCE: 1%; VOLTAGE: 75V

## Net classes
1 unfused_hv: clearance 0.025 mm to class 0, clearance 3.2 mm

## Board
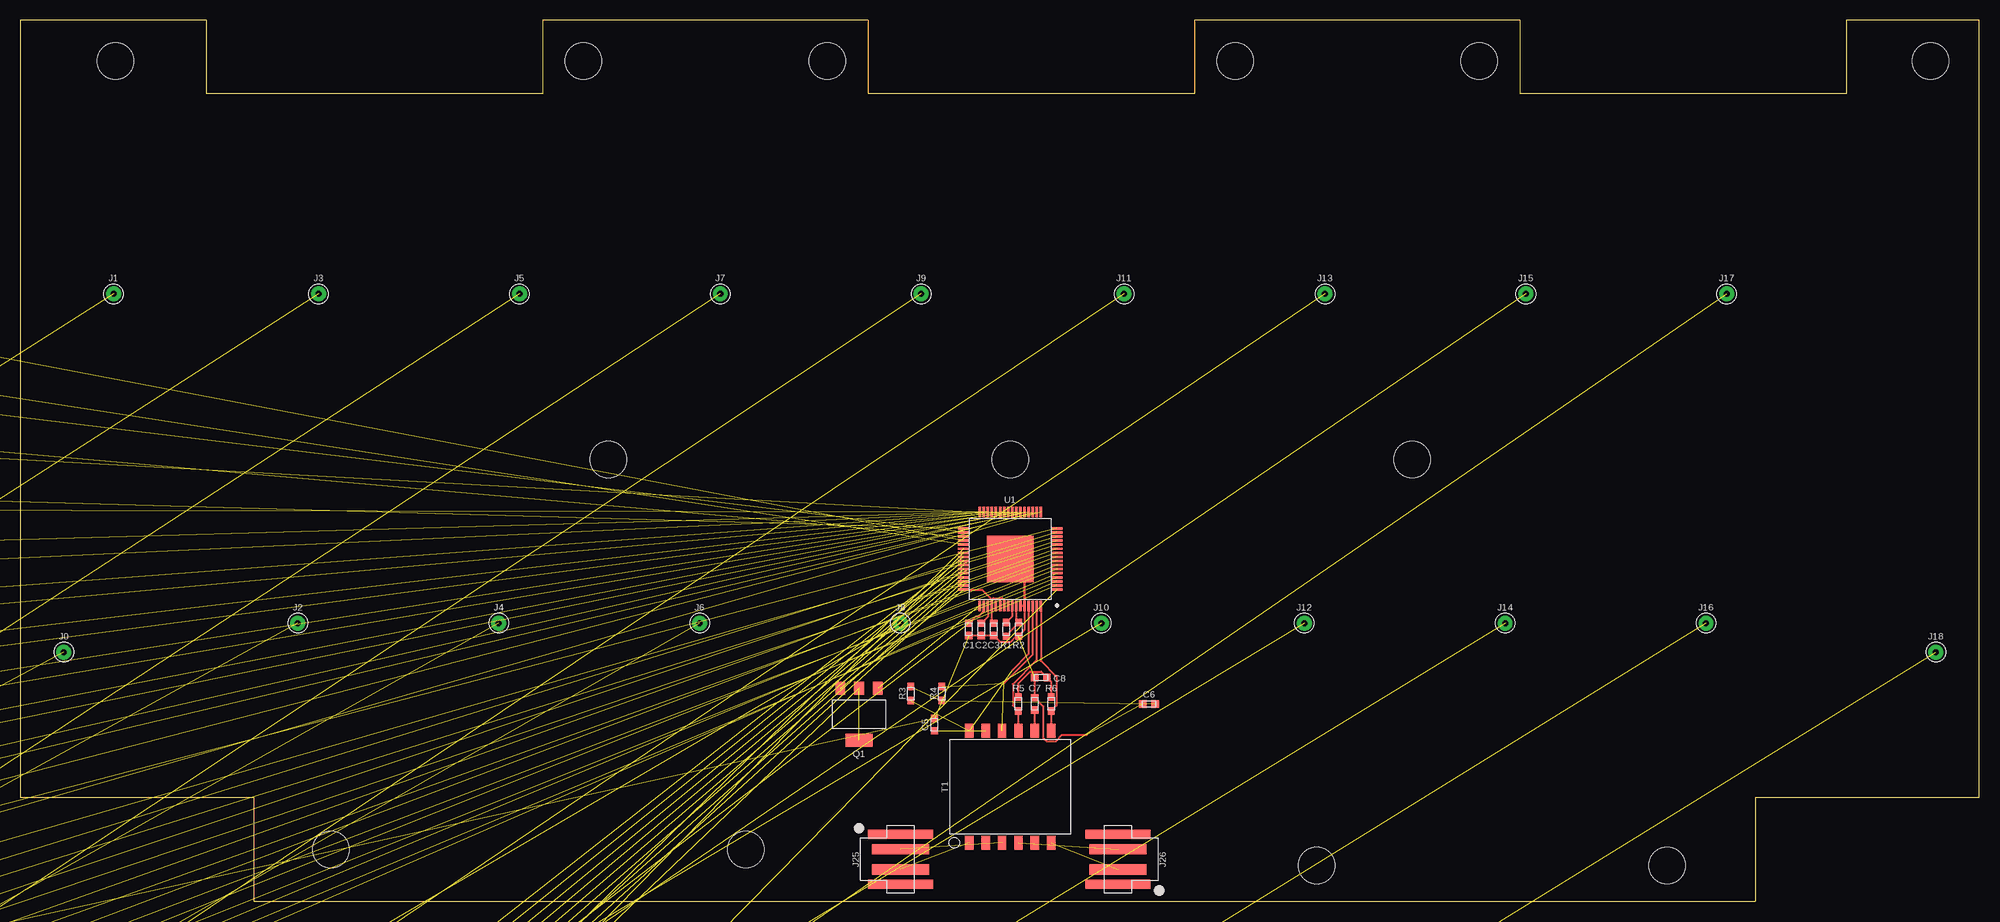
[diagram p3: board, top side]

Size 240.25 x 108 mm. Coordinates in mm from the lower left corner, seen from the top.
Outline: 223.93,99 183.93,99 183.93,108 143.99,108 143.99,99 103.99,99 103.99,108 64.05,108 64.05,99 22.77,99 22.77,108 0,108 0,12.7 28.7,12.7 28.7,0 212.82,0 212.82,12.7 240.25,12.7 240.25,108 223.93,108 223.93,99
Copper layers (1*16): Top 0.035mm / dielectric 1.5mm / Bottom 0.035mm
Design rules "default": minimum track width 6mil, minimum drill 0.35mm, track to track 6mil, track to pad 6mil, pad to pad 6mil, via to via 6mil, smd to smd 6mil, copper to edge 40mil, drill to drill 6mil, minimum pad ring 10mil, minimum via ring 8mil, stop-mask expansion 4mil, vias tented up to drill 0mil, thermal gap 10mil

### Footprints (pad centres in the part's own frame; a part is rotated, then mirrored left to right if it is on the bottom)
0603-CAP = smd 0.9 x 0.9: 1 -0.75,0; 2 0.75,0
0603-RES = smd 0.9 x 0.8: 1 -0.85,0; 2 0.85,0
0603-LED = smd 0.8 x 0.8: 1 -0.825,0; 2 0.825,0
SOT-23 = smd 0.711 x 0.889: 1 -0.94,-1.003; 2 0.94,-1.003; 3 0,1.003
PWR163 = smd 1.651 x 3.81: 1 -2.54,-7.366; 2 2.54,-7.366 | smd 7.874 x 8.509: PAD 0,0
0885 = smd 5.6 x 7.23: 1 -5,0; 2 5,0
807-22-001-10-02X101 = drill 0.737 pad 1.829: 1 0,0
MOLEX_NANOFIT_SMD_VERTICAL_02 = smd 1.24 x 7: 1 1.25,0; 2 -1.25,0 | smd 1.1 x 8: PAD 3.055,0; PAD1 -3.055,0
SOT223 = smd 1.2 x 1.6: 1 -2.3,-3.2; 2 0,-3.2; 3 2.3,-3.2 | smd 3.3 x 1.6: 4 0,3.2
HM2102NLT = smd 1.016 x 1.714: 1 -5.016,-6.89; 2 -3.01,-6.89; 3 -1.003,-6.89; 4 1.003,-6.89; 5 3.01,-6.89; 6 5.016,-6.89; 7 5.016,6.89; 8 3.01,6.89; 9 1.003,6.89; 10 -1.003,6.89; 11 -3.01,6.89; 12 -5.016,6.89
LQFP-64 = smd 1.3 x 0.3: 1 -5.75,3.75; 2 -5.75,3.25; 3 -5.75,2.75; 4 -5.75,2.25; 5 -5.75,1.75; 6 -5.75,1.25; 7 -5.75,0.75; 8 -5.75,0.25; 9 -5.75,-0.25; 10 -5.75,-0.75; 11 -5.75,-1.25; 12 -5.75,-1.75; 13 -5.75,-2.25; 14 -5.75,-2.75; 15 -5.75,-3.25; 16 -5.75,-3.75; 33 5.75,-3.75; 34 5.75,-3.25; 35 5.75,-2.75; 36 5.75,-2.25; 37 5.75,-1.75; 38 5.75,-1.25; 39 5.75,-0.75; 40 5.75,-0.25; 41 5.75,0.25; 42 5.75,0.75; 43 5.75,1.25; 44 5.75,1.75; 45 5.75,2.25; 46 5.75,2.75; 47 5.75,3.25; 48 5.75,3.75 | smd 0.3 x 1.3: 17 -3.75,-5.75; 18 -3.25,-5.75; 19 -2.75,-5.75; 20 -2.25,-5.75; 21 -1.75,-5.75; 22 -1.25,-5.75; 23 -0.75,-5.75; 24 -0.25,-5.75; 25 0.25,-5.75; 26 0.75,-5.75; 27 1.25,-5.75; 28 1.75,-5.75; 29 2.25,-5.75; 30 2.75,-5.75; 31 3.25,-5.75; 32 3.75,-5.75; 49 3.75,5.75; 50 3.25,5.75; 51 2.75,5.75; 52 2.25,5.75; 53 1.75,5.75; 54 1.25,5.75; 55 0.75,5.75; 56 0.25,5.75; 57 -0.25,5.75; 58 -0.75,5.75; 59 -1.25,5.75; 60 -1.75,5.75; 61 -2.25,5.75; 62 -2.75,5.75; 63 -3.25,5.75; 64 -3.75,5.75 | smd 5.74 x 5.74: 65 0,0
M4_MOUNTING = hole 4.5: 0,0

### Placement (x,y rotation side)
C1  116.33,33.32 270 top
C2  117.86,33.32 270 top
C3  119.38,33.32 270 top
C5  112.12,21.64 90 top
C6  138.43,24.18 0 top
C7  124.42,24.18 270 top
C8  125.17,27.42 180 top
CELL0.C1  -614.68,-669.24 0 top  (outside the outline)
CELL0.R1  -614.68,-665.43 0 top  (outside the outline)
CELL1:C1  CAPACITOR_0603_100V_10NF  [0603-CAP]  -205.74,105.46 0 top  (outside the outline)
CELL1:D1  [0603-LED]  -205.74,101.65 0 top  (outside the outline)
CELL1:Q1  TRANSISTOR_P_MOS_SOT23_SI2369DS-T1-GE3  [SOT-23]  -210.82,102.92 0 top  (outside the outline)
CELL1:R1  RESISTOR_0603_100  [0603-RES]  -210.82,97.84 0 top  (outside the outline)
CELL1:R2  RESISTOR_0603_3.3K  [0603-RES]  -210.82,94.03 0 top  (outside the outline)
CELL1:R3  RESISTOR_PWR163_5  [PWR163]  -158.75,-30.43 0 top  (outside the outline)
CELL1:R4  RESISTOR_0603_1K  [0603-RES]  -222.25,90.22 0 top  (outside the outline)
CELL2:C1  CAPACITOR_0603_100V_10NF  [0603-CAP]  -222.25,86.41 0 top  (outside the outline)
CELL2:D1  [0603-LED]  -222.25,82.6 0 top  (outside the outline)
CELL2:Q1  TRANSISTOR_P_MOS_SOT23_SI2369DS-T1-GE3  [SOT-23]  -227.33,83.87 0 top  (outside the outline)
CELL2:R1  RESISTOR_0603_100  [0603-RES]  -227.33,78.79 0 top  (outside the outline)
CELL2:R2  RESISTOR_0603_3.3K  [0603-RES]  -227.33,74.98 0 top  (outside the outline)
CELL2:R3  RESISTOR_PWR163_5  [PWR163]  -236.22,85.14 0 top  (outside the outline)
CELL2:R4  RESISTOR_0603_1K  [0603-RES]  -238.76,71.17 0 top  (outside the outline)
CELL3:C1  CAPACITOR_0603_100V_10NF  [0603-CAP]  -238.76,67.36 0 top  (outside the outline)
CELL3:D1  [0603-LED]  -238.76,63.55 0 top  (outside the outline)
CELL3:Q1  TRANSISTOR_P_MOS_SOT23_SI2369DS-T1-GE3  [SOT-23]  -243.84,64.82 0 top  (outside the outline)
CELL3:R1  RESISTOR_0603_100  [0603-RES]  -243.84,59.74 0 top  (outside the outline)
CELL3:R2  RESISTOR_0603_3.3K  [0603-RES]  -243.84,55.93 0 top  (outside the outline)
CELL3:R3  RESISTOR_PWR163_5  [PWR163]  -252.73,66.09 0 top  (outside the outline)
CELL3:R4  RESISTOR_0603_1K  [0603-RES]  -255.27,52.12 0 top  (outside the outline)
CELL4:C1  CAPACITOR_0603_100V_10NF  [0603-CAP]  -255.27,48.31 0 top  (outside the outline)
CELL4:D1  [0603-LED]  -255.27,44.5 0 top  (outside the outline)
CELL4:Q1  TRANSISTOR_P_MOS_SOT23_SI2369DS-T1-GE3  [SOT-23]  -260.35,45.77 0 top  (outside the outline)
CELL4:R1  RESISTOR_0603_100  [0603-RES]  -260.35,40.69 0 top  (outside the outline)
CELL4:R2  RESISTOR_0603_3.3K  [0603-RES]  -260.35,36.88 0 top  (outside the outline)
CELL4:R3  RESISTOR_PWR163_5  [PWR163]  -269.24,47.04 0 top  (outside the outline)
CELL4:R4  RESISTOR_0603_1K  [0603-RES]  -271.78,33.07 0 top  (outside the outline)
CELL5:C1  CAPACITOR_0603_100V_10NF  [0603-CAP]  -271.78,29.26 0 top  (outside the outline)
CELL5:D1  [0603-LED]  -271.78,25.45 0 top  (outside the outline)
CELL5:Q1  TRANSISTOR_P_MOS_SOT23_SI2369DS-T1-GE3  [SOT-23]  -276.86,26.72 0 top  (outside the outline)
CELL5:R1  RESISTOR_0603_100  [0603-RES]  -276.86,21.64 0 top  (outside the outline)
CELL5:R2  RESISTOR_0603_3.3K  [0603-RES]  -276.86,17.83 0 top  (outside the outline)
CELL5:R3  RESISTOR_PWR163_5  [PWR163]  -285.75,27.99 0 top  (outside the outline)
CELL5:R4  RESISTOR_0603_1K  [0603-RES]  -288.29,14.02 0 top  (outside the outline)
CELL6:C1  CAPACITOR_0603_100V_10NF  [0603-CAP]  -288.29,10.21 0 top  (outside the outline)
CELL6:D1  [0603-LED]  -288.29,6.4 0 top  (outside the outline)
CELL6:Q1  TRANSISTOR_P_MOS_SOT23_SI2369DS-T1-GE3  [SOT-23]  -293.37,7.67 0 top  (outside the outline)
CELL6:R1  RESISTOR_0603_100  [0603-RES]  -293.37,2.59 0 top  (outside the outline)
CELL6:R2  RESISTOR_0603_3.3K  [0603-RES]  -293.37,-1.22 0 top  (outside the outline)
CELL6:R3  RESISTOR_PWR163_5  [PWR163]  -302.26,8.94 0 top  (outside the outline)
CELL6:R4  RESISTOR_0603_1K  [0603-RES]  -304.8,-5.03 0 top  (outside the outline)
CELL7:C1  CAPACITOR_0603_100V_10NF  [0603-CAP]  -304.8,-8.84 0 top  (outside the outline)
CELL7:D1  [0603-LED]  -304.8,-12.65 0 top  (outside the outline)
CELL7:Q1  TRANSISTOR_P_MOS_SOT23_SI2369DS-T1-GE3  [SOT-23]  -309.88,-11.38 0 top  (outside the outline)
CELL7:R1  RESISTOR_0603_100  [0603-RES]  -309.88,-16.46 0 top  (outside the outline)
CELL7:R2  RESISTOR_0603_3.3K  [0603-RES]  -309.88,-20.27 0 top  (outside the outline)
CELL7:R3  RESISTOR_PWR163_5  [PWR163]  -318.77,-10.11 0 top  (outside the outline)
CELL7:R4  RESISTOR_0603_1K  [0603-RES]  -321.31,-24.08 0 top  (outside the outline)
CELL8:C1  CAPACITOR_0603_100V_10NF  [0603-CAP]  -321.31,-27.89 0 top  (outside the outline)
CELL8:D1  [0603-LED]  -321.31,-31.7 0 top  (outside the outline)
CELL8:Q1  TRANSISTOR_P_MOS_SOT23_SI2369DS-T1-GE3  [SOT-23]  -326.39,-30.43 0 top  (outside the outline)
CELL8:R1  RESISTOR_0603_100  [0603-RES]  -326.39,-35.51 0 top  (outside the outline)
CELL8:R2  RESISTOR_0603_3.3K  [0603-RES]  -326.39,-39.32 0 top  (outside the outline)
CELL8:R3  RESISTOR_PWR163_5  [PWR163]  -335.28,-29.16 0 top  (outside the outline)
CELL8:R4  RESISTOR_0603_1K  [0603-RES]  -337.82,-43.13 0 top  (outside the outline)
CELL9:C1  CAPACITOR_0603_100V_10NF  [0603-CAP]  -337.82,-46.94 0 top  (outside the outline)
CELL9:D1  [0603-LED]  -337.82,-50.75 0 top  (outside the outline)
CELL9:Q1  TRANSISTOR_P_MOS_SOT23_SI2369DS-T1-GE3  [SOT-23]  -342.9,-49.48 0 top  (outside the outline)
CELL9:R1  RESISTOR_0603_100  [0603-RES]  -342.9,-54.56 0 top  (outside the outline)
CELL9:R2  RESISTOR_0603_3.3K  [0603-RES]  -342.9,-58.37 0 top  (outside the outline)
CELL9:R3  RESISTOR_PWR163_5  [PWR163]  -351.79,-48.21 0 top  (outside the outline)
CELL9:R4  RESISTOR_0603_1K  [0603-RES]  -354.33,-62.18 0 top  (outside the outline)
CELL10:C1  CAPACITOR_0603_100V_10NF  [0603-CAP]  -354.33,-65.99 0 top  (outside the outline)
CELL10:D1  [0603-LED]  -354.33,-69.8 0 top  (outside the outline)
CELL10:Q1  TRANSISTOR_P_MOS_SOT23_SI2369DS-T1-GE3  [SOT-23]  -359.41,-68.53 0 top  (outside the outline)
CELL10:R1  RESISTOR_0603_100  [0603-RES]  -359.41,-73.61 0 top  (outside the outline)
CELL10:R2  RESISTOR_0603_3.3K  [0603-RES]  -359.41,-77.42 0 top  (outside the outline)
CELL10:R3  RESISTOR_PWR163_5  [PWR163]  -368.3,-67.26 0 top  (outside the outline)
CELL10:R4  RESISTOR_0603_1K  [0603-RES]  -370.84,-81.23 0 top  (outside the outline)
CELL11:C1  CAPACITOR_0603_100V_10NF  [0603-CAP]  -370.84,-85.04 0 top  (outside the outline)
CELL11:D1  [0603-LED]  -370.84,-88.85 0 top  (outside the outline)
CELL11:Q1  TRANSISTOR_P_MOS_SOT23_SI2369DS-T1-GE3  [SOT-23]  -375.92,-87.58 0 top  (outside the outline)
CELL11:R1  RESISTOR_0603_100  [0603-RES]  -375.92,-92.66 0 top  (outside the outline)
CELL11:R2  RESISTOR_0603_3.3K  [0603-RES]  -375.92,-96.47 0 top  (outside the outline)
CELL11:R3  RESISTOR_PWR163_5  [PWR163]  -384.81,-86.31 0 top  (outside the outline)
CELL11:R4  RESISTOR_0603_1K  [0603-RES]  -387.35,-100.28 0 top  (outside the outline)
CELL12:C1  CAPACITOR_0603_100V_10NF  [0603-CAP]  -387.35,-104.09 0 top  (outside the outline)
CELL12:D1  [0603-LED]  -387.35,-107.9 0 top  (outside the outline)
CELL12:Q1  TRANSISTOR_P_MOS_SOT23_SI2369DS-T1-GE3  [SOT-23]  -392.43,-106.63 0 top  (outside the outline)
CELL12:R1  RESISTOR_0603_100  [0603-RES]  -392.43,-111.71 0 top  (outside the outline)
CELL12:R2  RESISTOR_0603_3.3K  [0603-RES]  -392.43,-115.52 0 top  (outside the outline)
CELL12:R3  RESISTOR_PWR163_5  [PWR163]  -401.32,-105.36 0 top  (outside the outline)
CELL12:R4  RESISTOR_0603_1K  [0603-RES]  -403.86,-119.33 0 top  (outside the outline)
CELL13:C1  CAPACITOR_0603_100V_10NF  [0603-CAP]  -403.86,-123.14 0 top  (outside the outline)
CELL13:D1  [0603-LED]  -403.86,-126.95 0 top  (outside the outline)
CELL13:Q1  TRANSISTOR_P_MOS_SOT23_SI2369DS-T1-GE3  [SOT-23]  -408.94,-125.68 0 top  (outside the outline)
CELL13:R1  RESISTOR_0603_100  [0603-RES]  -408.94,-130.76 0 top  (outside the outline)
CELL13:R2  RESISTOR_0603_3.3K  [0603-RES]  -408.94,-134.57 0 top  (outside the outline)
CELL13:R3  RESISTOR_PWR163_5  [PWR163]  -417.83,-124.41 0 top  (outside the outline)
CELL13:R4  RESISTOR_0603_1K  [0603-RES]  -420.37,-138.38 0 top  (outside the outline)
CELL14:C1  CAPACITOR_0603_100V_10NF  [0603-CAP]  -420.37,-142.19 0 top  (outside the outline)
CELL14:D1  [0603-LED]  -420.37,-146 0 top  (outside the outline)
CELL14:Q1  TRANSISTOR_P_MOS_SOT23_SI2369DS-T1-GE3  [SOT-23]  -425.45,-144.73 0 top  (outside the outline)
CELL14:R1  RESISTOR_0603_100  [0603-RES]  -425.45,-149.81 0 top  (outside the outline)
CELL14:R2  RESISTOR_0603_3.3K  [0603-RES]  -425.45,-153.62 0 top  (outside the outline)
CELL14:R3  RESISTOR_PWR163_5  [PWR163]  -434.34,-143.46 0 top  (outside the outline)
CELL14:R4  RESISTOR_0603_1K  [0603-RES]  -436.88,-157.43 0 top  (outside the outline)
CELL15:C1  CAPACITOR_0603_100V_10NF  [0603-CAP]  -436.88,-161.24 0 top  (outside the outline)
CELL15:D1  [0603-LED]  -436.88,-165.05 0 top  (outside the outline)
CELL15:Q1  TRANSISTOR_P_MOS_SOT23_SI2369DS-T1-GE3  [SOT-23]  -441.96,-163.78 0 top  (outside the outline)
CELL15:R1  RESISTOR_0603_100  [0603-RES]  -441.96,-168.86 0 top  (outside the outline)
CELL15:R2  RESISTOR_0603_3.3K  [0603-RES]  -441.96,-172.67 0 top  (outside the outline)
CELL15:R3  RESISTOR_PWR163_5  [PWR163]  -450.85,-162.51 0 top  (outside the outline)
CELL15:R4  RESISTOR_0603_1K  [0603-RES]  -453.39,-176.48 0 top  (outside the outline)
CELL16:C1  CAPACITOR_0603_100V_10NF  [0603-CAP]  -453.39,-180.29 0 top  (outside the outline)
CELL16:D1  [0603-LED]  -453.39,-184.1 0 top  (outside the outline)
CELL16:Q1  TRANSISTOR_P_MOS_SOT23_SI2369DS-T1-GE3  [SOT-23]  -458.47,-182.83 0 top  (outside the outline)
CELL16:R1  RESISTOR_0603_100  [0603-RES]  -458.47,-187.91 0 top  (outside the outline)
CELL16:R2  RESISTOR_0603_3.3K  [0603-RES]  -458.47,-191.72 0 top  (outside the outline)
CELL16:R3  RESISTOR_PWR163_5  [PWR163]  -467.36,-181.56 0 top  (outside the outline)
CELL16:R4  RESISTOR_0603_1K  [0603-RES]  -469.9,-195.53 0 top  (outside the outline)
CELL17:C1  CAPACITOR_0603_100V_10NF  [0603-CAP]  -469.9,-199.34 0 top  (outside the outline)
CELL17:D1  [0603-LED]  -469.9,-203.15 0 top  (outside the outline)
CELL17:Q1  TRANSISTOR_P_MOS_SOT23_SI2369DS-T1-GE3  [SOT-23]  -474.98,-201.88 0 top  (outside the outline)
CELL17:R1  RESISTOR_0603_100  [0603-RES]  -474.98,-206.96 0 top  (outside the outline)
CELL17:R2  RESISTOR_0603_3.3K  [0603-RES]  -474.98,-210.77 0 top  (outside the outline)
CELL17:R3  RESISTOR_PWR163_5  [PWR163]  -483.87,-200.61 0 top  (outside the outline)
CELL17:R4  RESISTOR_0603_1K  [0603-RES]  -486.41,-214.58 0 top  (outside the outline)
CELL18:C1  CAPACITOR_0603_100V_10NF  [0603-CAP]  -486.41,-218.39 0 top  (outside the outline)
CELL18:D1  [0603-LED]  -486.41,-222.2 0 top  (outside the outline)
CELL18:Q1  TRANSISTOR_P_MOS_SOT23_SI2369DS-T1-GE3  [SOT-23]  -491.49,-220.93 0 top  (outside the outline)
CELL18:R1  RESISTOR_0603_100  [0603-RES]  -491.49,-226.01 0 top  (outside the outline)
CELL18:R2  RESISTOR_0603_3.3K  [0603-RES]  -491.49,-229.82 0 top  (outside the outline)
CELL18:R3  RESISTOR_PWR163_5  [PWR163]  -500.38,-219.66 0 top  (outside the outline)
CELL18:R4  RESISTOR_0603_1K  [0603-RES]  -502.92,-233.63 0 top  (outside the outline)
DRIVE.C1  -614.68,-684.48 0 top  (outside the outline)
DRIVE.R1  -614.68,-657.81 0 top  (outside the outline)
F0  -496.57,-241.25 0 top  (outside the outline)
F1  -496.57,-251.41 0 top  (outside the outline)
F2  -496.57,-261.57 0 top  (outside the outline)
F3  -496.57,-271.73 0 top  (outside the outline)
F4  -496.57,-281.89 0 top  (outside the outline)
F5  -496.57,-292.05 0 top  (outside the outline)
F6  -496.57,-302.21 0 top  (outside the outline)
F7  -496.57,-312.37 0 top  (outside the outline)
F8  -496.57,-322.53 0 top  (outside the outline)
F9  -496.57,-332.69 0 top  (outside the outline)
F10  -496.57,-342.85 0 top  (outside the outline)
F11  -496.57,-353.01 0 top  (outside the outline)
F12  -496.57,-363.17 0 top  (outside the outline)
F13  -496.57,-373.33 0 top  (outside the outline)
F14  -496.57,-383.49 0 top  (outside the outline)
F15  -496.57,-393.65 0 top  (outside the outline)
F16  -496.57,-403.81 0 top  (outside the outline)
F17  -496.57,-413.97 0 top  (outside the outline)
F18  -496.57,-424.13 0 top  (outside the outline)
J0  5.33,30.53 0 top
J1  11.43,74.47 0 top
J2  34.04,34.09 0 top
J3  36.58,74.47 0 top
J4  58.67,34.09 0 top
J5  61.21,74.47 0 top
J6  83.31,34.09 0 top
J7  85.85,74.47 0 top
J8  107.95,34.09 0 top
J9  110.49,74.47 0 top
J10  132.59,34.09 0 top
J11  135.38,74.47 0 top
J12  157.48,34.09 0 top
J13  160.02,74.47 0 top
J14  182.12,34.09 0 top
J15  184.66,74.47 0 top
J16  206.76,34.09 0 top
J17  209.3,74.47 0 top
J18  234.95,30.53 0 top
J19  -533.4,-651.46 0 top  (outside the outline)
J20  -542.29,-651.46 0 top  (outside the outline)
J21  -551.18,-651.46 0 top  (outside the outline)
J22  -560.07,-651.46 0 top  (outside the outline)
J23  -568.96,-651.46 0 top  (outside the outline)
J24  -577.85,-651.46 0 top  (outside the outline)
J25  107.95,5.13 90 top
J26  134.62,5.13 270 top
J27  -633.73,-722.58 0 top  (outside the outline)
J28  -624.84,-722.58 0 top  (outside the outline)
Q1  102.87,22.91 180 top
R1  120.9,33.32 90 top
R2  122.43,33.32 90 top
R3  109.22,25.45 90 top
R4  113.03,25.45 90 top
R5  122.42,24.18 270 top
R6  126.43,24.18 270 top
RT1  -502.92,-534.62 0 top  (outside the outline)
RT2  -502.92,-538.43 0 top  (outside the outline)
RT3  -502.92,-542.24 0 top  (outside the outline)
SENSE18.C1  -615.95,-718.77 0 top  (outside the outline)
SENSE18.R1  -614.68,-661.62 0 top  (outside the outline)
T1  121.41,14.02 0 top
THERM1:C1  CAPACITOR_0603_100V_10NF  [0603-CAP]  -502.92,-431.75 0 top  (outside the outline)
THERM1:R1  RESISTOR_0603_100  [0603-RES]  -502.92,-435.56 0 top  (outside the outline)
THERM1:R2  RESISTOR_0603_10K  [0603-RES]  -502.92,-439.37 0 top  (outside the outline)
THERM2:C1  CAPACITOR_0603_100V_10NF  [0603-CAP]  -502.92,-443.18 0 top  (outside the outline)
THERM2:R1  RESISTOR_0603_100  [0603-RES]  -502.92,-446.99 0 top  (outside the outline)
THERM2:R2  RESISTOR_0603_10K  [0603-RES]  -502.92,-450.8 0 top  (outside the outline)
THERM3:C1  CAPACITOR_0603_100V_10NF  [0603-CAP]  -502.92,-454.61 0 top  (outside the outline)
THERM3:R1  RESISTOR_0603_100  [0603-RES]  -502.92,-458.42 0 top  (outside the outline)
THERM3:R2  RESISTOR_0603_10K  [0603-RES]  -502.92,-462.23 0 top  (outside the outline)
THERM4:C1  CAPACITOR_0603_100V_10NF  [0603-CAP]  -502.92,-466.04 0 top  (outside the outline)
THERM4:R1  RESISTOR_0603_100  [0603-RES]  -502.92,-469.85 0 top  (outside the outline)
THERM4:R2  RESISTOR_0603_10K  [0603-RES]  -502.92,-473.66 0 top  (outside the outline)
THERM5:C1  CAPACITOR_0603_100V_10NF  [0603-CAP]  -502.92,-477.47 0 top  (outside the outline)
THERM5:R1  RESISTOR_0603_100  [0603-RES]  -502.92,-481.28 0 top  (outside the outline)
THERM5:R2  RESISTOR_0603_10K  [0603-RES]  -502.92,-485.09 0 top  (outside the outline)
THERM6:C1  CAPACITOR_0603_100V_10NF  [0603-CAP]  -502.92,-488.9 0 top  (outside the outline)
THERM6:R1  RESISTOR_0603_100  [0603-RES]  -502.92,-492.71 0 top  (outside the outline)
THERM6:R2  RESISTOR_0603_10K  [0603-RES]  -502.92,-496.52 0 top  (outside the outline)
THERM7:C1  CAPACITOR_0603_100V_10NF  [0603-CAP]  -502.92,-500.33 0 top  (outside the outline)
THERM7:R1  RESISTOR_0603_100  [0603-RES]  -502.92,-504.14 0 top  (outside the outline)
THERM7:R2  RESISTOR_0603_10K  [0603-RES]  -502.92,-507.95 0 top  (outside the outline)
THERM8:C1  CAPACITOR_0603_100V_10NF  [0603-CAP]  -502.92,-511.76 0 top  (outside the outline)
THERM8:R1  RESISTOR_0603_100  [0603-RES]  -502.92,-515.57 0 top  (outside the outline)
THERM8:R2  RESISTOR_0603_10K  [0603-RES]  -502.92,-519.38 0 top  (outside the outline)
THERM9:C1  CAPACITOR_0603_100V_10NF  [0603-CAP]  -502.92,-523.19 0 top  (outside the outline)
THERM9:R1  RESISTOR_0603_100  [0603-RES]  -502.92,-527 0 top  (outside the outline)
THERM9:R2  RESISTOR_0603_10K  [0603-RES]  -502.92,-530.81 0 top  (outside the outline)
U1  121.41,41.96 180 top
U$9  [M4_MOUNTING]  170.69,54.15 270 top
U$10  [M4_MOUNTING]  178.94,103 270 top
U$11  [M4_MOUNTING]  98.99,103 270 top
U$12  [M4_MOUNTING]  69.05,103 270 top
U$13  [M4_MOUNTING]  11.67,103 270 top
U$14  [M4_MOUNTING]  38.11,6.35 270 top
U$15  [M4_MOUNTING]  201.99,4.35 270 top
U$16  [M4_MOUNTING]  158.99,4.35 270 top
U$17  [M4_MOUNTING]  88.99,6.35 270 top
U$18  [M4_MOUNTING]  72.14,54.15 270 top
U$19  [M4_MOUNTING]  121.41,54.15 270 top
U$26  [M4_MOUNTING]  234.28,103 270 top
U$27  [M4_MOUNTING]  148.99,103 270 top

### Tracks (layer width: path | path; a pad name or v marks a point on that pad's centre or on a via)
C0  (2 unrouted)
C1  (2 unrouted)
C2  (2 unrouted)
C3  (2 unrouted)
C4  (2 unrouted)
C5  (2 unrouted)
C6  (2 unrouted)
C7  (2 unrouted)
C8  (2 unrouted)
C9  (2 unrouted)
C10  (2 unrouted)
C11  (2 unrouted)
C12  (2 unrouted)
C13  (2 unrouted)
C14  (2 unrouted)
C15  (2 unrouted)
C16  (2 unrouted)
C17  (2 unrouted)
C18  (2 unrouted)
CC0  (1 unrouted)
CC1  (1 unrouted)
CC2  (1 unrouted)
CC3  (1 unrouted)
CC4  (1 unrouted)
CC5  (1 unrouted)
CC6  (1 unrouted)
CC7  (1 unrouted)
CC8  (1 unrouted)
CC9  (1 unrouted)
CC10  (1 unrouted)
CC11  (1 unrouted)
CC12  (1 unrouted)
CC13  (1 unrouted)
CC14  (1 unrouted)
CC15  (1 unrouted)
CC16  (1 unrouted)
CC17  (1 unrouted)
CC18  (1 unrouted)
CELL1:N$5  (1 unrouted)
CELL1:N$6  (2 unrouted)
CELL1:N$7  (1 unrouted)
CELL2:N$5  (1 unrouted)
CELL2:N$6  (2 unrouted)
CELL2:N$7  (1 unrouted)
CELL3:N$5  (1 unrouted)
CELL3:N$6  (2 unrouted)
CELL3:N$7  (1 unrouted)
CELL4:N$5  (1 unrouted)
CELL4:N$6  (2 unrouted)
CELL4:N$7  (1 unrouted)
CELL5:N$5  (1 unrouted)
CELL5:N$6  (2 unrouted)
CELL5:N$7  (1 unrouted)
CELL6:N$5  (1 unrouted)
CELL6:N$6  (2 unrouted)
CELL6:N$7  (1 unrouted)
CELL7:N$5  (1 unrouted)
CELL7:N$6  (2 unrouted)
CELL7:N$7  (1 unrouted)
CELL8:N$5  (1 unrouted)
CELL8:N$6  (2 unrouted)
CELL8:N$7  (1 unrouted)
CELL9:N$5  (1 unrouted)
CELL9:N$6  (2 unrouted)
CELL9:N$7  (1 unrouted)
CELL10:N$5  (1 unrouted)
CELL10:N$6  (2 unrouted)
CELL10:N$7  (1 unrouted)
CELL11:N$5  (1 unrouted)
CELL11:N$6  (2 unrouted)
CELL11:N$7  (1 unrouted)
CELL12:N$5  (1 unrouted)
CELL12:N$6  (2 unrouted)
CELL12:N$7  (1 unrouted)
CELL13:N$5  (1 unrouted)
CELL13:N$6  (2 unrouted)
CELL13:N$7  (1 unrouted)
CELL14:N$5  (1 unrouted)
CELL14:N$6  (2 unrouted)
CELL14:N$7  (1 unrouted)
CELL15:N$5  (1 unrouted)
CELL15:N$6  (2 unrouted)
CELL15:N$7  (1 unrouted)
CELL16:N$5  (1 unrouted)
CELL16:N$6  (2 unrouted)
CELL16:N$7  (1 unrouted)
CELL17:N$5  (1 unrouted)
CELL17:N$6  (2 unrouted)
CELL17:N$7  (1 unrouted)
CELL18:N$5  (1 unrouted)
CELL18:N$6  (2 unrouted)
CELL18:N$7  (1 unrouted)
DRIVE  (1 unrouted)
GPIO1  (1 unrouted)
GPIO1_PRE  (2 unrouted)
GPIO2  (2 unrouted)
GPIO3  (2 unrouted)
GPIO4  (2 unrouted)
GPIO5  (2 unrouted)
GPIO6  (2 unrouted)
GPIO7  (2 unrouted)
GPIO8  (2 unrouted)
GPIO9  (2 unrouted)
IBIAS
  Top 0.254: R1.2 121.66,34.93 U1.57
ICMP
  Top 0.254: R1.1 122.48,34.23 R2.2 122.16,34.49 U1.58
IMA  (2 unrouted)
  Top 0.254: U1.61 123.66,30.31 121.63,28.28
IMB
  Top 0.254: T1.9 R5.2 121.74,24.01 121.74,26.6 124.66,29.53 U1.63
IPA  (2 unrouted)
  Top 0.254: U1.62 124.16,30.23 120.65,26.72
IPB
  Top 0.254: T1.7 R6.2 127.11,24.01 127.11,27.53 125.16,29.47 U1.64
ISO_IMA  (1 unrouted)
ISO_IMB  (1 unrouted)
ISO_IPA  (1 unrouted)
ISO_IPB  (1 unrouted)
N$3  (1 unrouted)
N$4
  Top 0.254: T1.8 C7.2
N$5  (2 unrouted)
N$15  (3 unrouted)
N$18
  Top 0.254: R6.1 126.43,26.91 C8.1 125.19,28.15 123.86,28.15 122.42,26.71 R5.1
S1  (1 unrouted)
S2  (1 unrouted)
S3  (1 unrouted)
S4  (1 unrouted)
S5  (1 unrouted)
S6  (1 unrouted)
S7  (1 unrouted)
S8  (1 unrouted)
S9  (1 unrouted)
S10  (1 unrouted)
S11  (1 unrouted)
S12  (1 unrouted)
S13  (1 unrouted)
S14  (1 unrouted)
S15  (1 unrouted)
S16  (1 unrouted)
S17  (1 unrouted)
S18  (1 unrouted)
SENSE1  (4 unrouted)
SENSE2  (4 unrouted)
SENSE3  (4 unrouted)
SENSE4  (4 unrouted)
SENSE5  (4 unrouted)
SENSE6  (4 unrouted)
SENSE7  (4 unrouted)
SENSE8  (4 unrouted)
SENSE9  (4 unrouted)
SENSE10  (4 unrouted)
SENSE11  (4 unrouted)
SENSE12  (4 unrouted)
SENSE13  (4 unrouted)
SENSE14  (4 unrouted)
SENSE15  (4 unrouted)
SENSE16  (4 unrouted)
SENSE17  (4 unrouted)
SENSE17_PRE  (1 unrouted)
SENSE18  (4 unrouted)
THERM1  (2 unrouted)
THERM2  (2 unrouted)
THERM3  (2 unrouted)
THERM4  (2 unrouted)
THERM5  (2 unrouted)
THERM6  (2 unrouted)
THERM7  (2 unrouted)
THERM8  (2 unrouted)
THERM9  (2 unrouted)
V+  (2 unrouted)
V-  (46 unrouted)
  Top 0.254: C8.2 C7.1 125.45,23.9 125.45,20.04 125.91,19.58 127,19.58 127.79,20.37 130.81,20.37 | U1.60 123.16,33.31 R2.1 122.15,32.47 121.42,31.75 120.21,31.75 C3.2 C2.2 C1.2
  Top 0.305: U1.59 U1.60 123.16,40.21 U1.65
VREF1
  Top 0.254: U1.51 118.66,34.88 C2.1
VREF2  (9 unrouted)
  Top 0.254: C1.1 117.16,34.9 117.55,34.9 118.16,35.52 U1.50
VREG  (1 unrouted)
  Top 0.254: U1.55 120.65,36.22 120.65,36.92 120.43,37.14 119.33,37.14 119.16,36.97 | 119.16,36.97 119.16,36.88 U1.52 119.16,34.29 C3.1 | U1.48 117.92,38.21 119.16,36.97